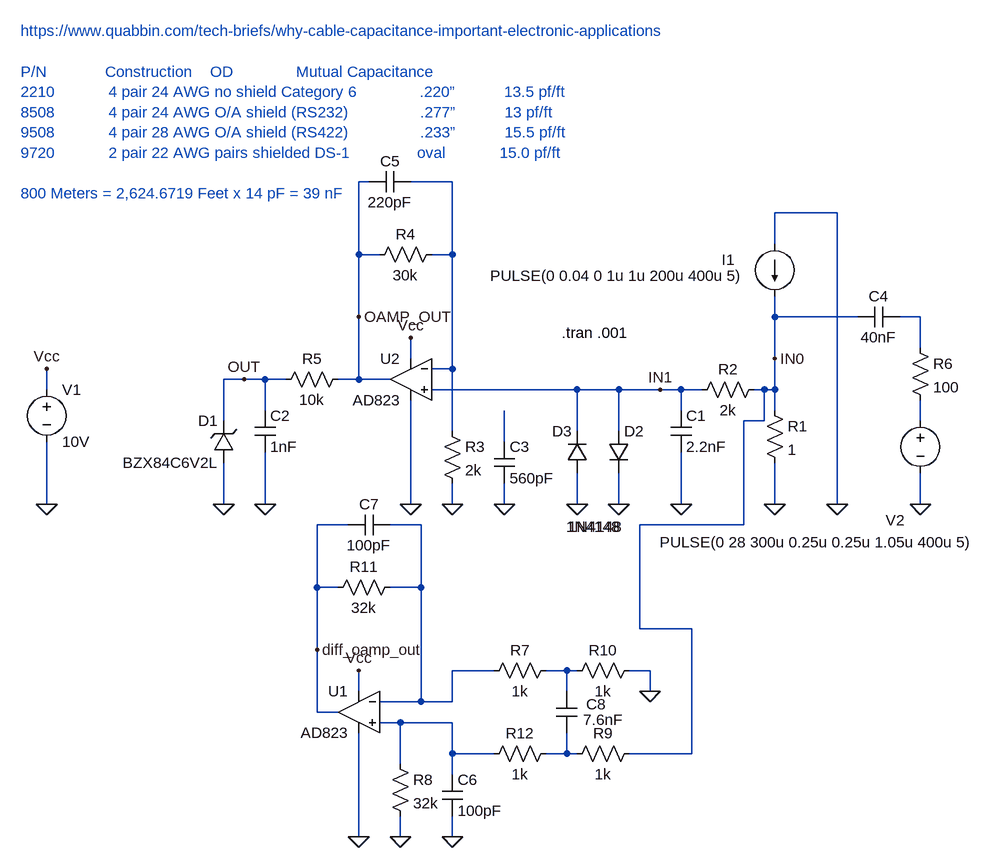
[diagram p0: schematic Filter.asc]
Filter.asc, the LTspice schematic file:
Version 4
SHEET 1 1472 836
WIRE -128 -192 -144 -192
WIRE 0 -192 -64 -192
WIRE 592 -144 496 -144
WIRE 496 -96 496 -144
WIRE -144 -80 -144 -192
WIRE -112 -80 -144 -80
WIRE 0 -80 0 -192
WIRE 0 -80 -32 -80
WIRE -144 16 -144 -80
WIRE 496 16 496 -16
WIRE 624 16 496 16
WIRE 720 16 688 16
WIRE 720 64 720 16
WIRE -64 80 -64 48
WIRE 496 80 496 16
WIRE 0 96 0 -80
WIRE 0 96 -32 96
WIRE -320 112 -352 112
WIRE -288 112 -320 112
WIRE -256 112 -288 112
WIRE -144 112 -144 16
WIRE -144 112 -176 112
WIRE -96 112 -144 112
WIRE -624 128 -624 96
WIRE 192 128 -32 128
WIRE 256 128 192 128
WIRE 320 128 256 128
WIRE 352 128 320 128
WIRE 384 128 352 128
WIRE 480 128 464 128
WIRE 496 128 496 80
WIRE 496 128 480 128
WIRE -288 160 -288 112
WIRE 352 160 352 128
WIRE 496 160 496 128
WIRE -352 176 -352 112
WIRE 480 176 480 128
WIRE 480 176 448 176
WIRE 720 176 720 144
WIRE 0 192 0 96
WIRE 192 192 192 128
WIRE 256 192 256 128
WIRE 80 208 80 160
WIRE -624 304 -624 208
WIRE -352 304 -352 240
WIRE -288 304 -288 224
WIRE -64 304 -64 144
WIRE 0 304 0 272
WIRE 80 304 80 272
WIRE 192 304 192 256
WIRE 256 304 256 256
WIRE 352 304 352 224
WIRE 496 304 496 240
WIRE 592 304 592 -144
WIRE 720 304 720 256
WIRE -160 336 -208 336
WIRE -48 336 -96 336
WIRE 448 336 448 176
WIRE 448 336 288 336
WIRE -208 432 -208 336
WIRE -176 432 -208 432
WIRE -48 432 -48 336
WIRE -48 432 -96 432
WIRE 288 496 288 336
WIRE 368 496 288 496
WIRE -208 528 -208 432
WIRE 64 560 0 560
WIRE 176 560 144 560
WIRE 192 560 176 560
WIRE 304 560 272 560
WIRE -144 592 -144 560
WIRE 176 592 176 560
WIRE 304 592 304 560
WIRE -48 608 -48 432
WIRE -48 608 -112 608
WIRE 0 608 0 560
WIRE 0 608 -48 608
WIRE -208 624 -208 528
WIRE -176 624 -208 624
WIRE -80 640 -112 640
WIRE 0 640 -80 640
WIRE 0 688 0 640
WIRE 64 688 0 688
WIRE 176 688 176 656
WIRE 176 688 144 688
WIRE 192 688 176 688
WIRE 368 688 368 496
WIRE 368 688 272 688
WIRE -80 704 -80 640
WIRE 0 720 0 688
WIRE -144 816 -144 656
WIRE -80 816 -80 784
WIRE 0 816 0 784
FLAG 496 304 0
FLAG 352 304 0
FLAG 0 304 0
FLAG -64 304 0
FLAG -288 304 0
FLAG -64 48 Vcc
FLAG -352 304 0
FLAG 192 304 0
FLAG 256 304 0
FLAG -624 304 0
FLAG -624 96 Vcc
FLAG 80 304 0
FLAG 592 304 0
FLAG -144 16 OAMP_OUT
FLAG -320 112 OUT
FLAG 496 80 IN0
FLAG 320 128 IN1
FLAG 720 304 0
FLAG -80 816 0
FLAG -144 816 0
FLAG -144 560 Vcc
FLAG 0 816 0
FLAG 304 592 0
FLAG -208 528 diff_oamp_out
SYMBOL res 480 144 R0
SYMATTR InstName R1
SYMATTR Value 1
SYMBOL cap 336 160 R0
SYMATTR InstName C1
SYMATTR Value 2.2nF
SYMBOL res 480 112 R90
WINDOW 0 0 56 VBottom 2
WINDOW 3 32 56 VTop 2
SYMATTR InstName R2
SYMATTR Value 2k
SYMBOL res -16 176 R0
SYMATTR InstName R3
SYMATTR Value 2k
SYMBOL res -16 -96 R90
WINDOW 0 0 56 VBottom 2
WINDOW 3 32 56 VTop 2
SYMATTR InstName R4
SYMATTR Value 30k
SYMBOL res -160 96 R90
WINDOW 0 0 56 VBottom 2
WINDOW 3 32 56 VTop 2
SYMATTR InstName R5
SYMATTR Value 10k
SYMBOL cap -304 160 R0
SYMATTR InstName C2
SYMATTR Value 1nF
SYMBOL voltage -624 112 R0
WINDOW 123 0 0 Left 2
WINDOW 39 0 0 Left 2
SYMATTR InstName V1
SYMATTR Value 10V
SYMBOL zener -336 240 R180
WINDOW 0 24 64 Left 2
WINDOW 3 24 0 Left 2
SYMATTR InstName D1
SYMATTR Value BZX84C6V2L
SYMBOL diode 240 192 R0
WINDOW 3 -62 147 Left 2
SYMATTR Value 1N4148
SYMATTR InstName D2
SYMBOL diode 208 256 R180
WINDOW 0 24 64 Left 2
WINDOW 3 -52 -83 Left 2
SYMATTR InstName D3
SYMATTR Value 1N4148
SYMBOL cap 64 208 R0
SYMATTR InstName C3
SYMATTR Value 560pF
SYMBOL current 496 -96 R0
WINDOW 0 -82 24 Left 2
WINDOW 3 -438 49 Left 2
WINDOW 123 0 0 Left 2
WINDOW 39 0 0 Left 2
SYMATTR InstName I1
SYMATTR Value PULSE(0 0.04 0 1u 1u 200u 400u 5)
SYMBOL voltage 720 160 R0
WINDOW 123 0 0 Left 2
WINDOW 39 0 0 Left 2
WINDOW 0 -53 169 Left 2
WINDOW 3 -401 203 Left 2
SYMATTR InstName V2
SYMATTR Value PULSE(0 28 300u 0.25u 0.25u 1.05u 400u 5)
SYMBOL res 704 48 R0
SYMATTR InstName R6
SYMATTR Value 100
SYMBOL cap 688 0 R90
WINDOW 0 0 32 VBottom 2
WINDOW 3 32 32 VTop 2
SYMATTR InstName C4
SYMATTR Value 40nF
SYMATTR SpiceLine Lser=100.7uH
SYMBOL cap -64 -208 R90
WINDOW 0 0 32 VBottom 2
WINDOW 3 32 32 VTop 2
SYMATTR InstName C5
SYMATTR Value 220pF
SYMBOL Opamps\\AD823 -64 48 M0
SYMATTR InstName U2
SYMBOL res -96 688 R0
SYMATTR InstName R8
SYMATTR Value 32k
SYMBOL cap -16 720 R0
SYMATTR InstName C6
SYMATTR Value 100pF
SYMBOL Opamps\\AD823 -144 560 M0
SYMATTR InstName U1
SYMBOL res 288 672 R90
WINDOW 0 0 56 VBottom 2
WINDOW 3 32 56 VTop 2
SYMATTR InstName R9
SYMATTR Value 1k
SYMBOL res 288 544 R90
WINDOW 0 0 56 VBottom 2
WINDOW 3 32 56 VTop 2
SYMATTR InstName R10
SYMATTR Value 1k
SYMBOL res -80 416 R90
WINDOW 0 0 56 VBottom 2
WINDOW 3 32 56 VTop 2
SYMATTR InstName R11
SYMATTR Value 32k
SYMBOL cap -96 320 R90
WINDOW 0 0 32 VBottom 2
WINDOW 3 32 32 VTop 2
SYMATTR InstName C7
SYMATTR Value 100pF
SYMBOL res 160 544 R90
WINDOW 0 0 56 VBottom 2
WINDOW 3 32 56 VTop 2
SYMATTR InstName R7
SYMATTR Value 1k
SYMBOL res 160 672 R90
WINDOW 0 0 56 VBottom 2
WINDOW 3 32 56 VTop 2
SYMATTR InstName R12
SYMATTR Value 1k
SYMBOL cap 160 592 R0
WINDOW 0 46 20 Left 2
WINDOW 3 41 44 Left 2
SYMATTR InstName C8
SYMATTR Value 7.6nF
TEXT 168 40 Left 2 !.tran .001
TEXT -664 -424 Left 2 ;https://www.quabbin.com/tech-briefs/why-cable-capacitance-important-electronic-applications\n \nP/N             Construction    OD              Mutual Capacitance\n2210            4 pair 24 AWG no shield Category 6              .220”           13.5 pf/ft\n8508            4 pair 24 AWG O/A shield (RS232)                .277”           13 pf/ft\n9508            4 pair 28 AWG O/A shield (RS422)                .233”           15.5 pf/ft\n9720            2 pair 22 AWG pairs shielded DS-1               oval            15.0 pf/ft\n \n800 Meters = 2,624.6719 Feet x 14 pF = 39 nF

The netlist it stands for:
* Filter.asc
R1 IN0 0 1
C1 IN1 0 2.2nF
R2 IN0 IN1 2k
R3 N001 0 2k
R4 N001 OAMP_OUT 30k
R5 OAMP_OUT OUT 10k
C2 OUT 0 1nF
V1 Vcc 0 10V
D1 0 OUT BZX84C6V2L
D2 IN1 0 1N4148
D3 0 IN1 1N4148
C3 N004 0 560pF
I1 0 IN0 PULSE(0 0.04 0 1u 1u 200u 400u 5)
V2 N003 0 PULSE(0 28 300u 0.25u 0.25u 1.05u 400u 5)
R6 N002 N003 100
C4 N002 IN0 40nF Lser=100.7uH
C5 N001 OAMP_OUT 220pF
XU2 IN1 N001 Vcc 0 OAMP_OUT AD823  ; pins In+ In- V+ V- OUT
R8 N007 0 32k
C6 N007 0 100pF
XU1 N007 N005 Vcc 0 diff_oamp_out AD823  ; pins In+ In- V+ V- OUT
R9 IN0 N008 1k
R10 0 N006 1k
R11 N005 diff_oamp_out 32k
C7 N005 diff_oamp_out 100pF
R7 N006 N005 1k
R12 N008 N007 1k
C8 N006 N008 7.6nF
.model D D
.lib standard.dio
.tran .001
* https://www.quabbin.com/tech-briefs/why-cable-capacitance-important-electronic-applications
* P/N             Construction    OD              Mutual Capacitance
* 2210            4 pair 24 AWG no shield Category 6              .220”           13.5 pf/ft
* 8508            4 pair 24 AWG O/A shield (RS232)                .277”           13 pf/ft
* 9508            4 pair 28 AWG O/A shield (RS422)                .233”           15.5 pf/ft
* 9720            2 pair 22 AWG pairs shielded DS-1               oval            15.0 pf/ft
* 800 Meters = 2,624.6719 Feet x 14 pF = 39 nF
.lib ADI.lib
.backanno
.end